# EAGLE design OSO-BOOK-C1-01 (EAGLE 9.6.2)

## Sheet 1 of 2
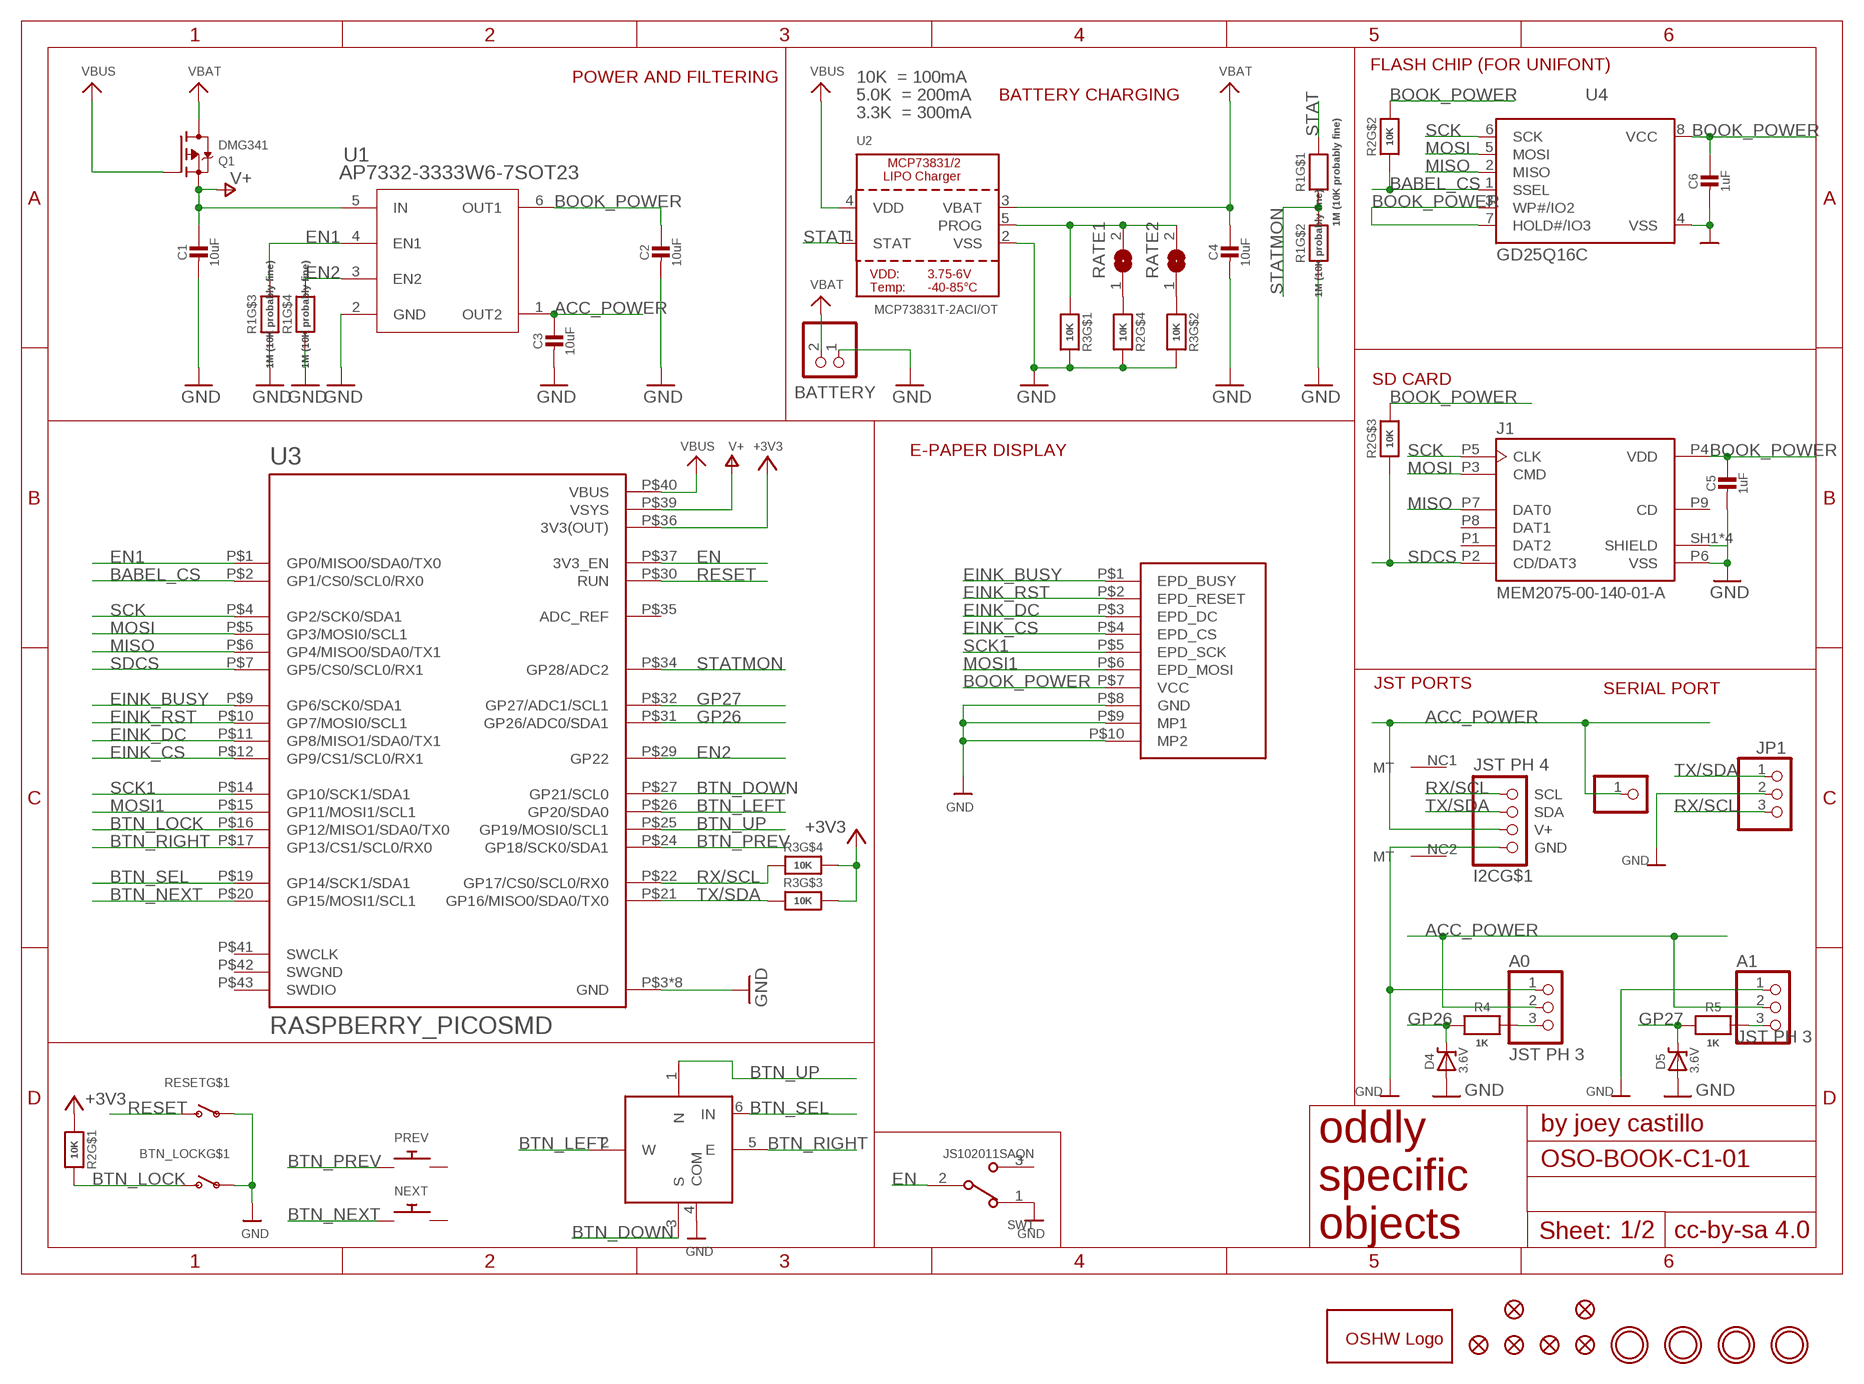
[diagram p0: schematic, sheet 1]

### Parts
A0  JST PH 3  CON_JST_PH_3PIN  [JSTPH3]
A1  JST PH 3  CON_JST_PH_3PIN  [JSTPH3]
BATTERY  JSTPH  CON_JST_PH_2PIN  [JSTPH2]
BTN_LOCK  SWITCH_SPSTTL3330A  [TL3330A]
C1  10uF  CAP_CERAMIC0805-NOOUTLINE  [0805-NO]
C2  10uF  CAP_CERAMIC0805-NOOUTLINE  [0805-NO]
C3  10uF  CAP_CERAMIC0805-NOOUTLINE  [0805-NO]
C4  10uF  CAP_CERAMIC0805-NOOUTLINE  [0805-NO]
C5  1uF  CAP_CERAMIC0805-NOOUTLINE  [0805-NO]
C6  1uF  CAP_CERAMIC0805-NOOUTLINE  [0805-NO]
D4  3.6V  DIODE-ZENERSOD123  [SOD-123]
D5  3.6V  DIODE-ZENERSOD123  [SOD-123]
FID1  FIDUCIAL_1MM  [FIDUCIAL_1MM]
FID2  FIDUCIAL_1MM  [FIDUCIAL_1MM]
FID3  FIDUCIAL_1MM  [FIDUCIAL_1MM]
FID4  FIDUCIAL_1MM  [FIDUCIAL_1MM]
FID5  FIDUCIAL_1MM  [FIDUCIAL_1MM]
FID6  FIDUCIAL_1MM  [FIDUCIAL_1MM]
GOLD_ORB_SM1  OSHWLOGOLOGO5MM  [OSHW_5MM]
I2C  JST PH 4  STEMMA_I2C_RASMT  [JSTPH4]
J1  MEM2075-00-140-01-A  [GCT_MEM2075-00-140-01-A]
JP1  PINHD-1X3  [1X03]
JP2  PINHD-1X1  [1X01]
NEXT  SWITCH_PUSHBUTTON_3.5X6MM  [TACTILE_3X6MM]
PREV  SWITCH_PUSHBUTTON_3.5X6MM  [TACTILE_3X6MM]
Q1  DMG341  MOSFET-P  [SOT23-R]
R1  1M (10K probably fine)  EXB-V8V103JV-GOOD  [EXBV8V]
R2  10K  EXB-V8V103JV-GOOD  [EXBV8V]
R3  10K  EXB-V8V103JV-GOOD  [EXBV8V]
R4  1K  RESISTOR0805_NOOUTLINE  [0805-NO]
R5  1K  RESISTOR0805_NOOUTLINE  [0805-NO]
RATE1  SOLDERJUMPER  [SOLDERJUMPER_ARROW_NOPASTE]
RATE2  SOLDERJUMPER  [SOLDERJUMPER_ARROW_NOPASTE]
RESET  SWITCH_SPSTTL3330A  [TL3330A]
SW1  JS102011SAQN  [SW_JS102011SAQN]
SW2  NAVSWITCHSKQUABAUE010  [SKQUBAE010]
U1  AP7332-3333W6-7SOT23  [SOT23-6]
U2  MCP73831T-2ACI/OT  MCP73831/2  [SOT23-5]
U3  RASPBERRY_PICOSMD  [PICO-PKG-SMD]
U4  GD25Q16C  MICROBUILDER_SPIFLASH_SOIC8  [MICROBUILDER_SOIC8_150MIL]
U$1  MOUNTINGHOLE2.5  [MOUNTINGHOLE_2.5_PLATED]
U$4  MOUNTINGHOLE2.5  [MOUNTINGHOLE_2.5_PLATED]
U$5  MOUNTINGHOLE2.5  [MOUNTINGHOLE_2.5_PLATED]
U$7  MOUNTINGHOLE2.5  [MOUNTINGHOLE_2.5_PLATED]
U$11  OSO-BOOK-C2-01  [OSO-BOOK-C2-01]

### Nets
+3V3: R2.1 R3.5 R3.6 U3.P$36(3V3(OUT))
_GP26: A0.3 R4.1
_GP27: A1.3 R5.1
ACC_POWER [power]: A0.2 A1.2 C3.1 I2C.2(V+) JP2.1 U1.1(OUT2)
BABEL_CS: R2.2 U3.P$2(GP1/CS0/SCL0/RX0) U4.1(SSEL)
BOOK_POWER [power]: C2.1 C5.1 C6.1 J1.P4(VDD) R2.6 R2.7 U1.6(OUT1) U4.3(WP#/IO2) U4.7(HOLD#/IO3) U4.8(VCC) U$11.P$7(VCC)
BTN_DOWN: SW2.3(S) U3.P$27(GP21/SCL0)
BTN_LEFT: SW2.2(W) U3.P$26(GP20/SDA0)
BTN_LOCK: BTN_LOCK.P$2(S) R2.8 U3.P$16(GP12/MISO1/SDA0/TX0)
BTN_NEXT: NEXT.P$1 U3.P$20(GP15/MOSI1/SCL1)
BTN_PREV: PREV.P$1 U3.P$24(GP18/SCK0/SDA1)
BTN_RIGHT: SW2.5(E) U3.P$17(GP13/CS1/SCL0/RX0)
BTN_SEL: SW2.6(IN) U3.P$19(GP14/SCK1/SDA1)
BTN_UP: SW2.1(N) U3.P$25(GP19/MOSI0/SCL1)
EINK_BUSY: U3.P$9(GP6/SCK0/SDA1) U$11.P$1(EPD_BUSY)
EINK_CS: U3.P$12(GP9/CS1/SCL0/RX1) U$11.P$4(EPD_CS)
EINK_DC: U3.P$11(GP8/MISO1/SDA0/TX1) U$11.P$3(EPD_DC)
EINK_RST: U3.P$10(GP7/MOSI0/SCL1) U$11.P$2(EPD_RESET)
EN: SW1.2 U3.P$37(3V3_EN)
EN1: R1.3 U1.4(EN1) U3.P$1(GP0/MISO0/SDA0/TX0)
EN2: R1.4 U1.3(EN2) U3.P$29(GP22)
GND [gnd]: A0.1 A1.1 BATTERY.1 BTN_LOCK.P$1(P) C1.2 C2.2 C3.2 C4.2 C5.2 C6.2 D4.A D5.A I2C.1(GND) J1.P6(VSS) J1.SH1(SHIELD) J1.SH2(SHIELD) J1.SH3(SHIELD) J1.SH4(SHIELD) JP1.2 R1.2 R1.5 R1.6 R2.5 R3.7 R3.8 RESET.P$1(P) SW1.1 SW2.4(COM) U1.2(GND) U2.2(VSS) U3.P$3(GND) U3.P$8(GND) U3.P$13(GND) U3.P$18(GND) U3.P$23(GND) U3.P$28(GND) U3.P$33(GND) U3.P$38(GND) U4.4(VSS) U$11.P$8(GND) U$11.P$9(MP1) U$11.P$10(MP2)
GP26: D4.C R4.2 U3.P$31(GP26/ADC0/SDA1)
GP27: D5.C R5.2 U3.P$32(GP27/ADC1/SCL1)
MISO: J1.P7(DAT0) U3.P$6(GP4/MISO0/SDA0/TX1) U4.2(MISO)
MOSI: J1.P3(CMD) U3.P$5(GP3/MOSI0/SCL1) U4.5(MOSI)
MOSI1: U3.P$15(GP11/MOSI1/SCL1) U$11.P$6(EPD_MOSI)
N$1: R2.4 RATE1.1
N$2: R3.2 RATE2.1
PROG: R3.1 RATE1.2 RATE2.2 U2.5(PROG)
RESET: RESET.P$2(S) U3.P$30(RUN)
RX/SCL: I2C.4(SCL) JP1.3 R3.4 U3.P$22(GP17/CS0/SCL0/RX0)
SCK: J1.P5(CLK) U3.P$4(GP2/SCK0/SDA1) U4.6(SCK)
SCK1: U3.P$14(GP10/SCK1/SDA1) U$11.P$5(EPD_SCK)
SDCS: J1.P2(CD/DAT3) R2.3 U3.P$7(GP5/CS0/SCL0/RX1)
STAT [power]: R1.8 U2.1(STAT)
STATMON: R1.1 R1.7 U3.P$34(GP28/ADC2)
TX/SDA: I2C.3(SDA) JP1.1 R3.3 U3.P$21(GP16/MISO0/SDA0/TX0)
V+ [power]: C1.1 Q1.2(S) U1.5(IN) U3.P$39(VSYS)
VBAT [power]: BATTERY.2 C4.1 Q1.3(D) U2.3(VBAT)
VBUS [power]: Q1.1(G) U2.4(VDD) U3.P$40(VBUS)
Unconnected: BTN_LOCK.P$3(MT) BTN_LOCK.P$4(MT) I2C.NC1(MT) I2C.NC2(MT) J1.P1(DAT2) J1.P8(DAT1) J1.P9(CD) NEXT.P$2 PREV.P$2 RESET.P$3(MT) RESET.P$4(MT) SW1.3 U3.P$35(ADC_REF) U3.P$41(SWCLK) U3.P$43(SWDIO)

### Notes on the sheet
- FLASH CHIP (FOR UNIFONT)
- POWER AND FILTERING | 10K  = 100mA
- 5.0K  = 200mA | BATTERY CHARGING
- 3.3K  = 300mA
- SD CARD
- E-PAPER DISPLAY
- JST PORTS
- SERIAL PORT

## Sheet 2 of 2
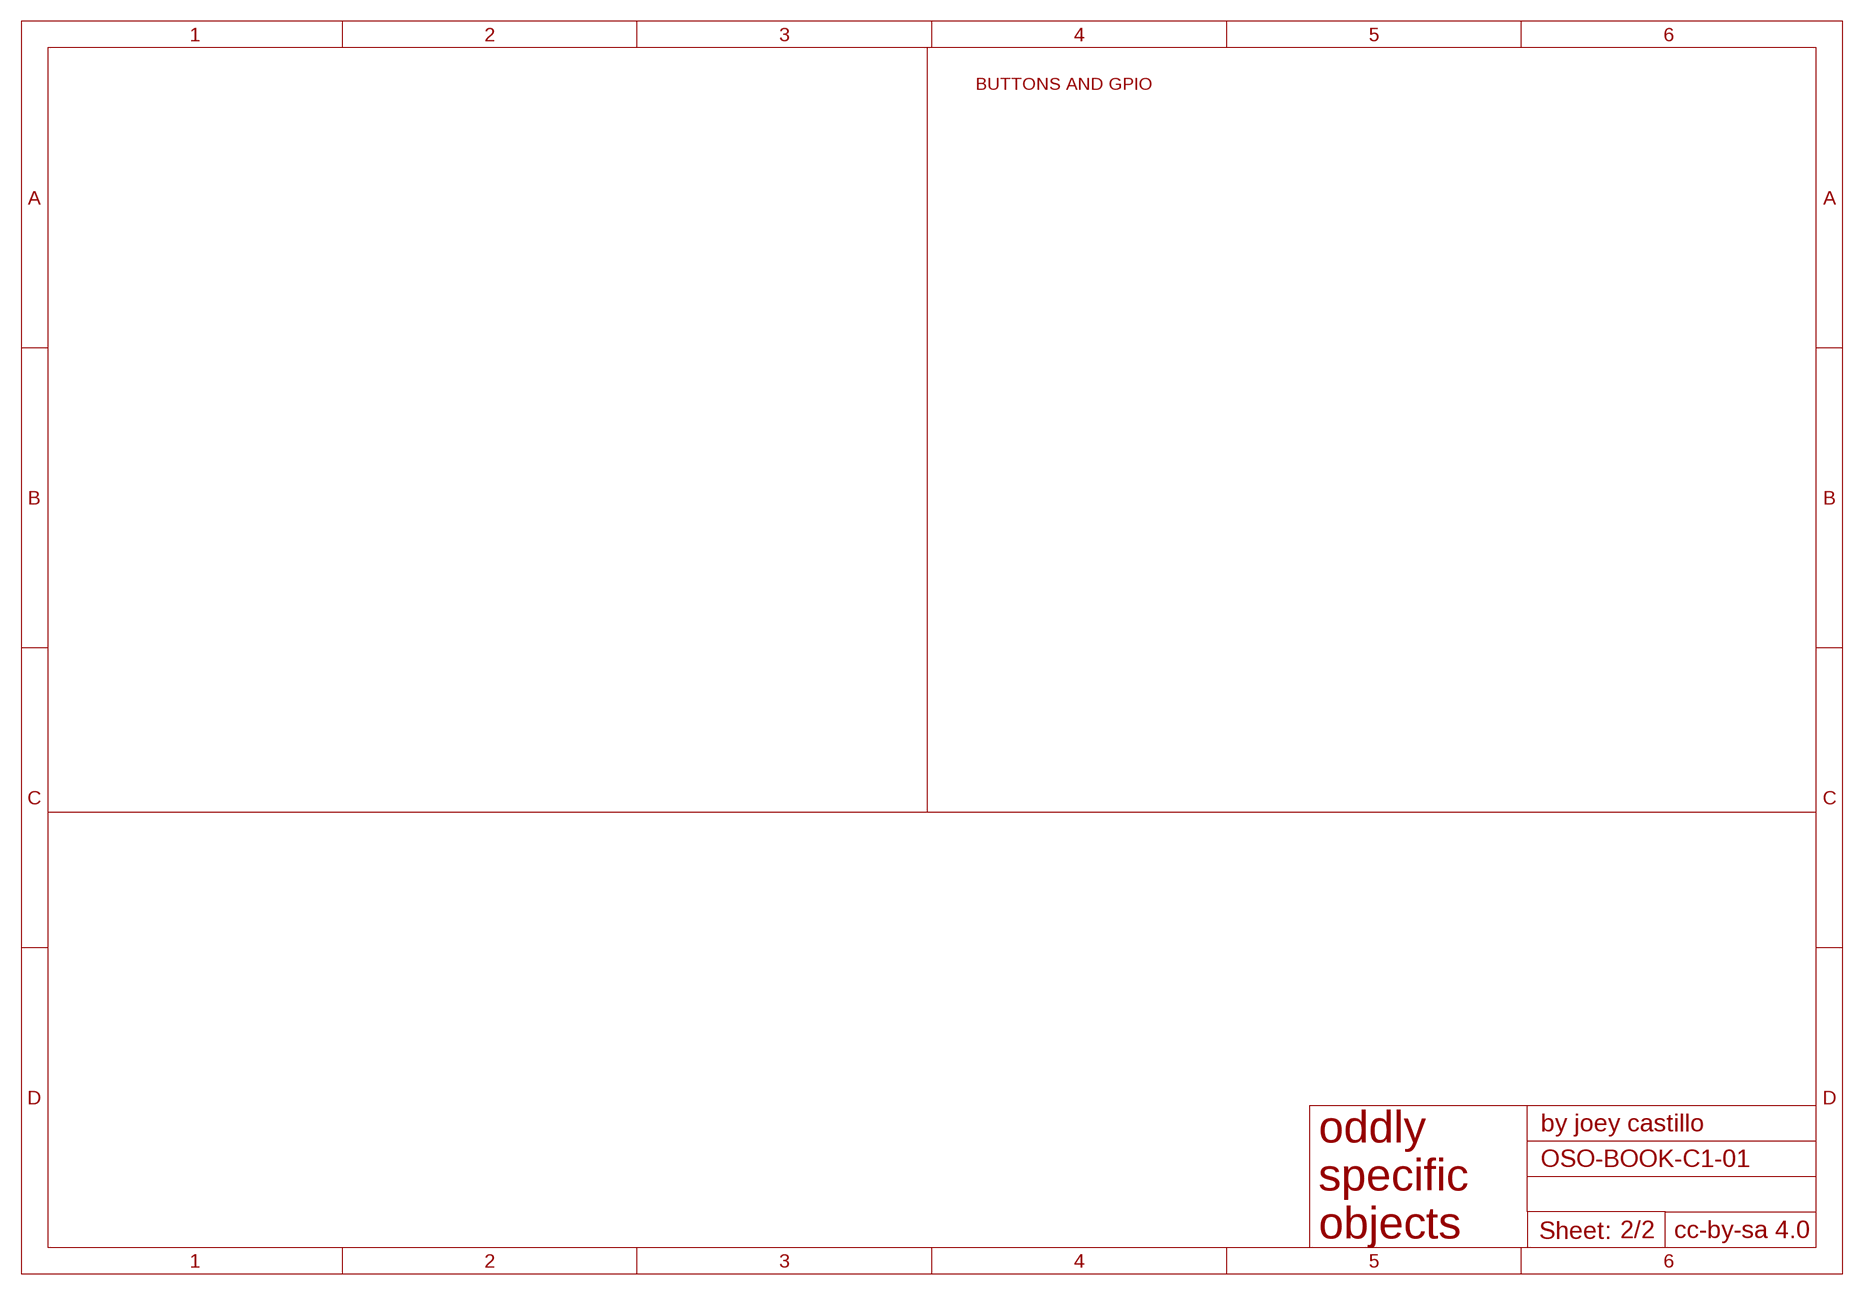
[diagram p1: schematic, sheet 2]

### Notes on the sheet
- BUTTONS AND GPIO

## Power pins joined to a net without a drawn wire
SWGND: U3.P$42(SWGND)

## Library data of the parts
A0 A1 = microbuilder:CON_JST_PH_3PIN
BATTERY = microbuilder:CON_JST_PH_2PIN: JST 2-Pin Right-Angle Connector PH-Series - 4UConnector: 17311 SH-Series - 4UConnector: 07278
BTN_LOCK RESET = oddlyspecific:SWITCH_SPST: Switch - SPST 4UCon 19192 (6.7x2.6mm SMT)
C1-C6 = microbuilder:CAP_CERAMIC: Ceramic Capacitors For new designs, use the packages preceded by an '_' character since they are more reliable: The following footprints should be used on most boards: _0402 - Standard footprint for regular board layouts _0603 - Standard footprint for regular board layouts _0805 - Standard footprint for regular board layouts _1206 - Standard footprint for regular board layouts For extremely tight-pitch boards where space is at a premium, the following 'micro-pitch' footprints can be used (smaller pads, no silkscreen outline, etc.): _0402MP - Micro-pitch footprint for very dense/compact boards _0603MP - Micro-pitch footprint for very dense/compact boards _0805MP - Micro-pitch footprint for very dense/compact boards _1206MP - Micro-pitch footprint for very dense/compact boards
D4 D5 = microbuilder:DIODE-ZENER: Zener Diode SMA: 30V 1W Zener Diode, 1.2Vf - Digikey: SMAZ30-FDICT-ND
FID1-FID6 = microbuilder:FIDUCIAL: Fiducial Alignment Points Various fiducial points for machine vision alignment.; BOM: EXCLUDE
GOLD_ORB_SM1 = oshw:OSHWLOGO: The OSHW logo for PCB layout
I2C = microbuilder:STEMMA_I2C
J1 = MEM2075-00-140-01-A:MEM2075-00-140-01-A: Micro SD Memory Card Connector, 1.4mm Profile SMT, Push-Push, with Normally open Switch; DESCRIPTION: 9 (8 + 1) Position Card Connector microSD Surface Mount, Right Angle Gold; MF: Global Connector Technology; MP: MEM2075-00-140-01-A; PACKAGE: Package
JP1 = adafruit:PINHD-1X3: PIN HEADER
JP2 = adafruit:PINHD-1X1: Pin header 1x1 for 0.1" spacing With round pins
NEXT PREV = microbuilder:SWITCH_PUSHBUTTON: Buttons SOFTTOUCHSMD_SJ - Soft touch temporary push button (Super Junk Akihabara) Compatible with SKPMANE010 [Mouser: 688-SKPMAN] C&K_KSS = Digikey: KSS221GLFS
Q1 = microbuilder:MOSFET-P: P-Channel Mosfet LEGEND VDS: Voltage Drain-Source ID: Drain Current RDS(ON): Drain-Source On-State Resistance VGS(TH): Gate-Source Threshold Voltage CISS: Drain-Source Input Capacitance SOT-23 Name VDS ID RDS(ON) VGS(TH) CISS Order Number IRLML5103 30V 760mA 600 mOhm -- 75pF @ 25V Digikey: IRLML5103PBFCT-ND IRLML6401 12V 4.3A 50 mOhm 950mV @ 250µA 830pF @ 10V Digikey: IRLML6401PBFTR-ND NTR0202PL 20V 400mA 800 mOhm 2.3V @ 250uA 70pF @ 5V Digikey: NTR0202PLT1GOSTR-ND NTR4101PT1G 20V 1.8A 85 mOhm 1.2V @ 250uA 675pF @ 10V Digikey: NTR4101PT1GOSCT-ND DMP2004K 20V 600mA 900 mOhm 1V @ 250uA 175pF @ 16V Digikey: DMP2004KDICT-ND PMV65XP 20V 3.9A 76 mOhm 950mV @ 1mA 725pF @ 20V Digikey: 568-2358-2-ND TO-252 Name VDS ID RDS(ON) VGS(TH) CISS Order Number AOD417 30V 25A 34 mOhm 3V @ 250µA 920pF @ 15V Digikey: 785-1106-2-ND PowerPak Name VDS ID RDS(ON) VGS(TH) CISS Order Number AON7401 30V 12A 14 mOhm 3V @ 250µA 2600pF @ 15V Digikey: 785-1302-1-ND
R1-R3 = resistor array:EXB-V8V103JV-GOOD; MANUFACTURER_PART_NUMBER: EXBV8V103JV; VENDOR: Panasonic
R4 R5 = microbuilder:RESISTOR: Resistors For new designs, use the packages preceded by an '_' character since they are more reliable: The following footprints should be used on most boards: _0402 - Standard footprint for regular board layouts _0603 - Standard footprint for regular board layouts _0805 - Standard footprint for regular board layouts _1206 - Standard footprint for regular board layouts For extremely tight-pitch boards where space is at a premium, the following 'micro-pitch' footprints can be used (smaller pads, no silkscreen outline, etc.): _0402MP - Micro-pitch footprint for very dense/compact boards _0603MP - Micro-pitch footprint for very dense/compact boards _0805MP - Micro-pitch footprint for very dense/compact boards _1206MP - Micro-pitch footprint for very dense/compact boards
RATE1 RATE2 = microbuilder:SOLDERJUMPER: SMD Solder JUMPER Solder the two pads together to create a connection, or remove the solder to break it. REFLOW - Use this footprint for solder paste and reflow ovens. WAVE - Use this footprint for hand-soldering (larger pads). CLOSED - Has a trace between the two pads to ensure it is closed by default. The trace needs to be cut to disable the jumper, and can be closed again by creating a solder bridge between the two pads.; BOM: EXCLUDE
SW1 = JS102011SAQN:JS102011SAQN: JS10 Series SPDT On-On 6 V 0.3 A Gull Wing SMT Slide Switch http://www.snapeda.com/parts/JS102011SAQN/C%26K%20Components/view-part/; DESCRIPTION: Slide Switch SPDT Surface Mount, Right Angle; DIGI-KEY_PART_NUMBER: 401-1999-1-ND; DIGI-KEY_PURCHASE_URL: https://www.digikey.com/product-detail/en/c-k/JS102011SAQN/401-1999-1-ND/1640114?utm_source=snapeda&utm_medium=aggregator&utm_campaign=symbol; MF: C&K; MP: JS102011SAQN; PACKAGE: None
SW2 = My Stuff:NAVSWITCH
U1 = My Stuff:AP7332-3333W6-7
U2 = microbuilder:MCP73831/2: MCP73831/2 LIPO Charger VDD: 3.75 - 6V Temp -40 - 85°C Programmable Charge Rate: 15-500mA NOTE: STAT is a tri-state logic output on the MCP73831 and an open-drain output on the MCP73832. SOT23-5 with 4.2V output and tri-state logic on STAT = MCP73831T-2ACI/OT
U3 = RpiPico:RASPBERRY_PICO: Raspberry Pi Pico
U4 = Adafruit Feather M0 Express:MICROBUILDER_SPIFLASH_SOIC8: SOIC8 SPI Flash Be careful with the size since SOIC8 flash comes in several 'widths' SOIC8 150 mil M25P16 - 16Mbit (2Mbit x 8) Serial Flash (75MHz SPI Bus), Supply: 2.7-3.6V Digikey: SOIC8 - M25P16-VMN6P-ND SOIC8 208 mil W25Q16BVSSIG - 16Mbit (2Mbit x 8) Serial Flash (104MHz SPI Bus), Supply: 2.7-3.6V Digikey: SOIC8 - W25Q16BVSSIG-ND
U$1 U$4 U$5 U$7 = microbuilder:MOUNTINGHOLE: Mounting Hole For #2 screws (0.086"/2.18mm width, 0.094"/2.4mm hole) use 2.5mm; BOM: EXCLUDE
U$11 = My Stuff:OSO-BOOK-C2-01

## Net classes
0 default: width 0.152 mm, drill 0.254 mm
1 power: width 0.254 mm, drill 0.254 mm
2 gnd: width 0.305 mm, drill 0.305 mm

## Board
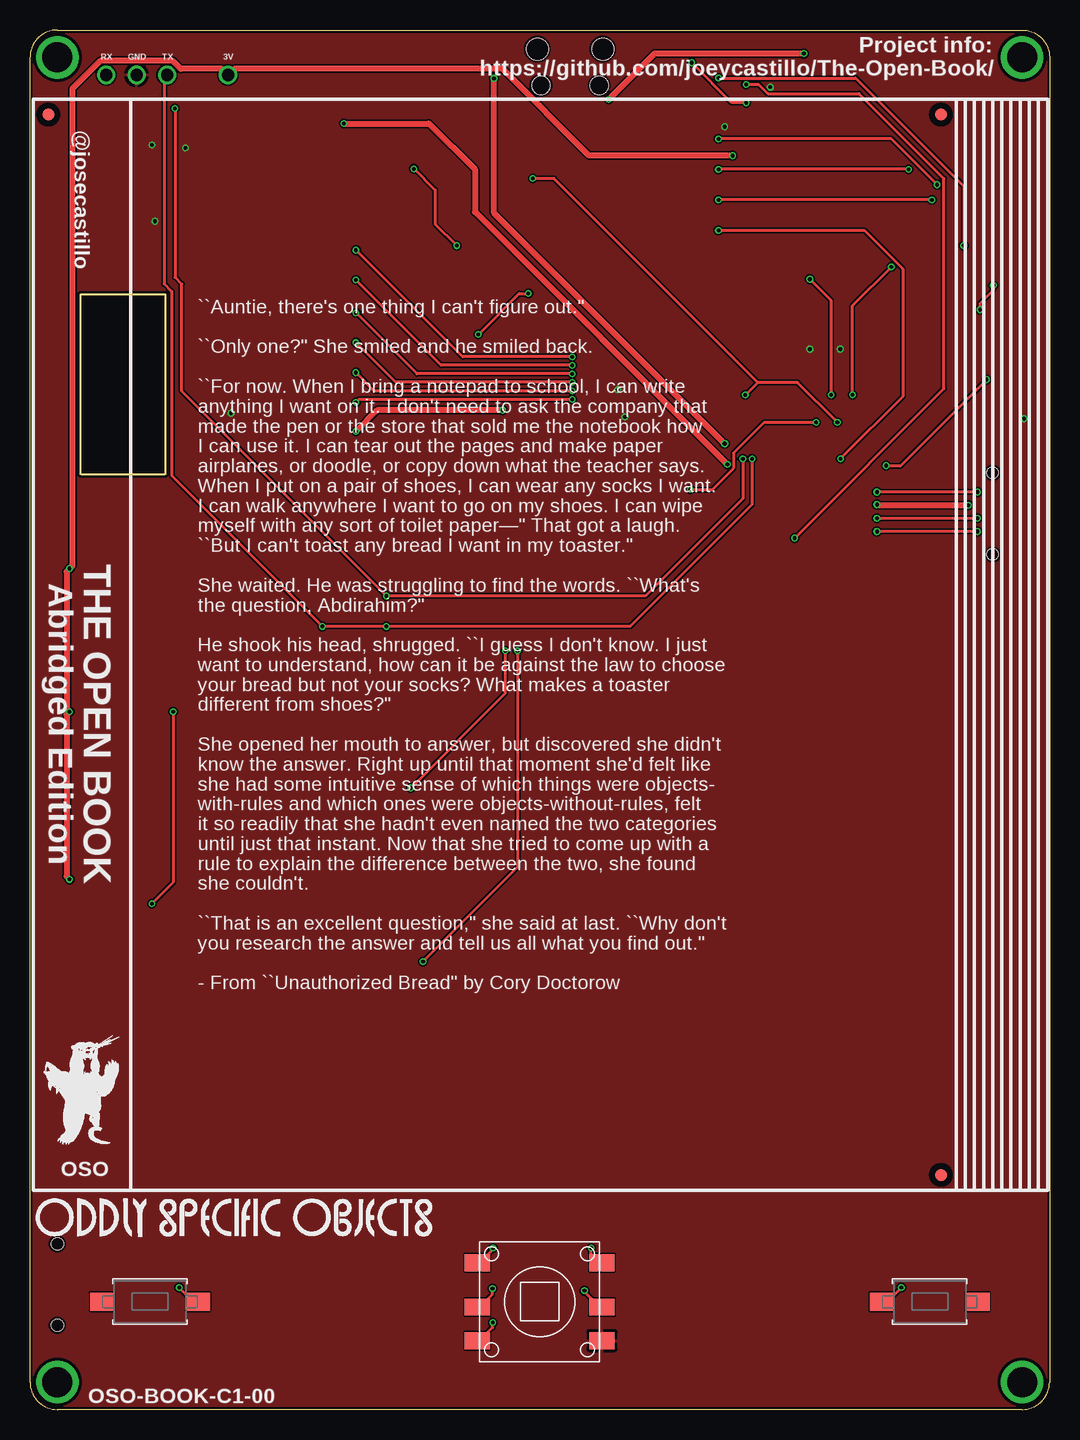
[diagram p2: board, top side]
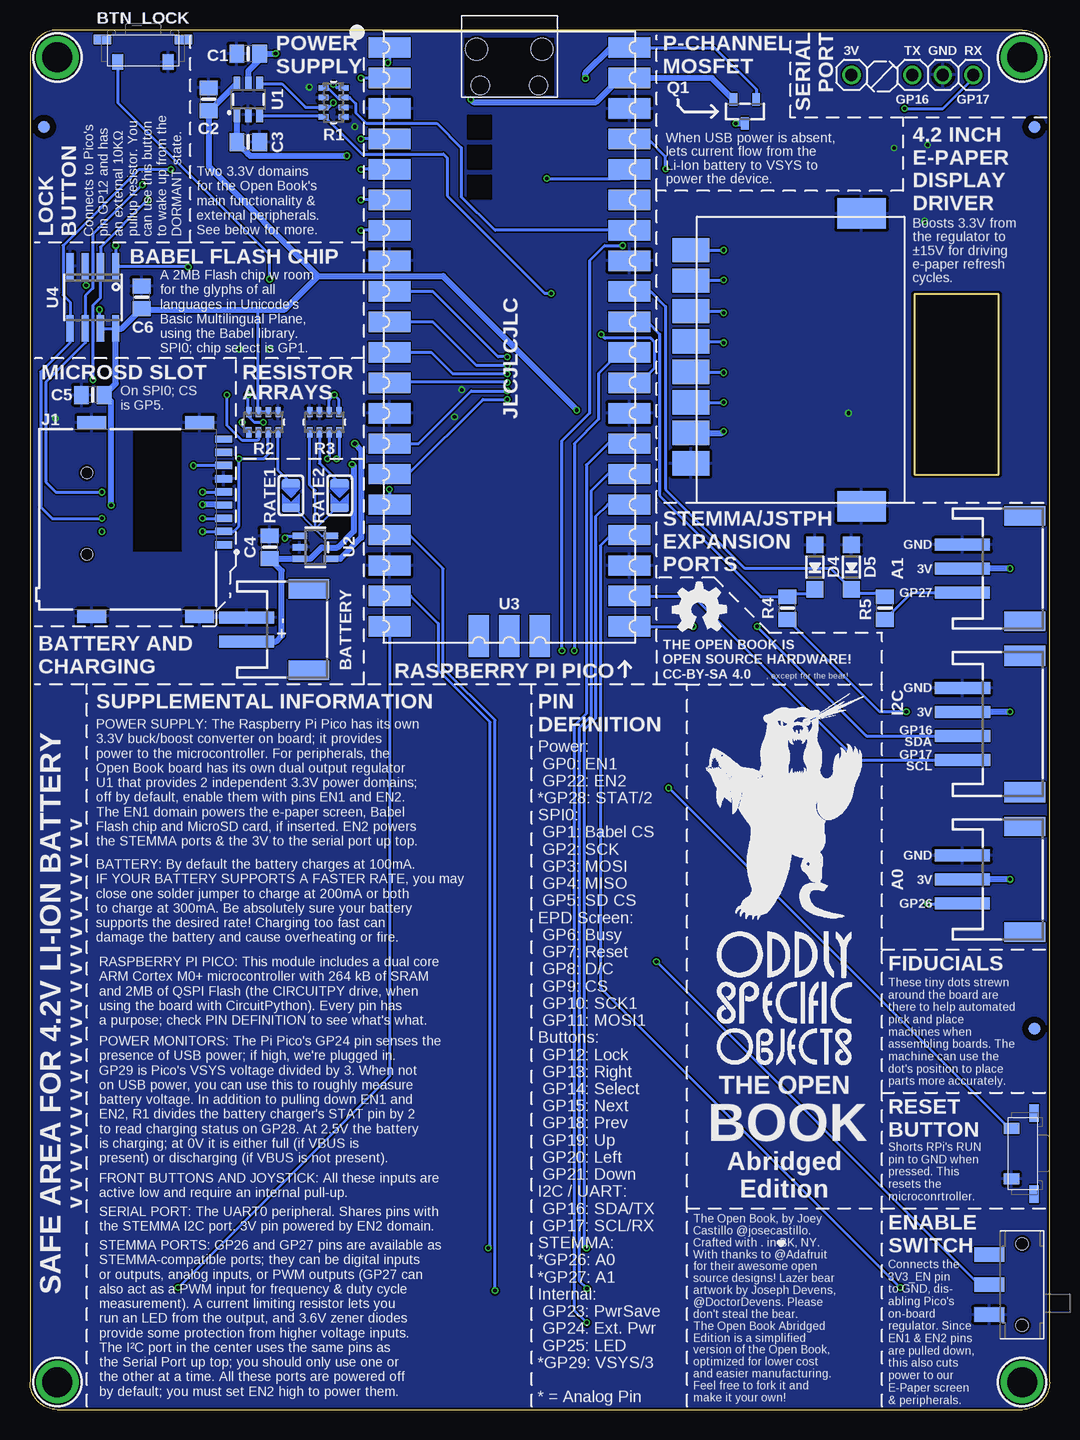
[diagram p3: board, bottom side, seen from below]

Size 85 x 115 mm. Coordinates in mm from the lower left corner, seen from the top.
Outline: 2.29,115 82.71,115 arc-90 85,112.71 85,2.29 arc-90 82.71,0 2.29,0 arc-90 0,2.29 0,112.71 arc-90 2.29,115
Outline: 4.24,92.96 11.25,92.96 11.25,77.95 4.24,77.95 4.24,92.96
Copper layers (1*16): Top 0.035559375mm / dielectric 1.6mm / Bottom 0.035559375mm
Design rules "jlcpcb2layer *": minimum track width 5mil, minimum drill 12mil, track to track 5mil, track to pad 5mil, pad to pad 5mil, via to via 5mil, smd to smd 5mil, copper to edge 8mil, drill to drill 6mil, minimum pad ring 5mil, minimum via ring 5mil, stop-mask expansion 2.5mil, vias tented up to drill 20mil, thermal gap 10mil
bKeepout: area -56,-78 to -6,-18; area 89,-143.7 to 125,-83.7; area -1,-78 to 69,-18; area 75,-78 to 125,-18; area 42,-135 to 84,-84
bRestrict: area 58.4,76.5 to 58.4,76.6; area 64,76.5 to 64.1,76.6

### Footprints (pad centres in the part's own frame; a part is rotated, then mirrored left to right if it is on the bottom)
JSTPH3 = smd 1 x 4.6: 1 -2,-2.7; 2 0,-2.7; 3 2,-2.7 | smd 1.6 x 3.4: NC1 -4.4,2.5; NC2 4.4,2.5
JSTPH2 = smd 1 x 4.6: 1 -1,-3.7; 2 1,-3.7 | smd 1.6 x 3.4: NC1 -3.4,1.5; NC2 3.4,1.5
TL3330A = smd 0.9 x 1.27: P$1 -2.1,0.89; P$2 2.1,0.89 | smd 1.45 x 0.8: P$3 -3.375,-1; P$4 3.375,-1
0805-NO = smd 1.24 x 1.5: 1 -0.95,0; 2 0.95,0
SOD-123 = smd 1.4 x 1.4: A 1.85,0; C -1.85,0
FIDUCIAL_1MM = smd 1 x 1: 1 0,0
JSTPH4 = smd 1 x 4.6: 1 -3,-3.7; 2 -1,-3.7; 3 1,-3.7; 4 3,-3.7 | smd 1.7 x 3.4: NC1 -5.7,1.5; NC2 5.7,1.5
GCT_MEM2075-00-140-01-A = smd 0.62 x 1.4: P1 2.58,11.42; P2 1.48,11.42; P3 0.38,11.42; P4 -0.72,11.42; P5 -1.82,11.42; P6 -2.92,11.42; P7 -4.02,11.42; P8 -5.12,11.42; P9 -6.22,11.42 | smd 1.1 x 2.4: SH1 -7.6,0.42; SH2 -7.6,9.42; SH3 8.55,9.42; SH4 8.55,0.42 | hole 0.95: -3.4,0; 3.4,0
1X03 = drill 1.016: 1 -2.54,0; 2 0,0; 3 2.54,0
1X01 = drill 1.016: 1 0,0
TACTILE_3X6MM = smd 2 x 1.5: P$1 -4,0; P$2 4,0
SOT23-R = smd 0.635 x 1.016: 1 -0.95,-1; 2 0.95,-1; 3 0,1
EXBV8V = smd 0.838 x 0.457: 1 -0.838,1.219; 2 -0.838,0.406; 3 -0.838,-0.406; 4 -0.838,-1.219; 5 0.838,-1.219; 6 0.838,-0.406; 7 0.838,0.406; 8 0.838,1.219
SOLDERJUMPER_ARROW_NOPASTE = smd 0.762 x 1.524: 1 -1.016,0; 2 1.016,0
SW_JS102011SAQN = smd 1.2 x 2.5: 1 -2.5,2.75; 2 0,2.75; 3 2.5,2.75 | hole 1: -3.4,0; 3.4,0
SKQUBAE010 = smd 2.1 x 1.4: 1 -5.2,3.25; 2 -5.2,-0.45; 3 -5.2,-3.25; 4 5.2,-3.25; 5 5.2,-0.45; 6 5.2,3.25
SOT23-6 = smd 0.55 x 1.2: 1 0.95,1.3; 2 0,1.3; 3 -0.95,1.3; 4 -0.95,-1.3; 5 0,-1.3; 6 0.95,-1.3
SOT23-5 = smd 0.55 x 1.2: 1 -0.95,-1.3; 2 0,-1.3; 3 0.95,-1.3; 4 0.95,1.3; 5 -0.95,1.3
PICO-PKG-SMD = smd 3.5 x 1.7: P$1 -10,24.13; P$2 -10,21.59; P$3 -10,19.05; P$4 -10,16.51; P$5 -10,13.97; P$6 -10,11.43; P$7 -10,8.89; P$8 -10,6.35; P$9 -10,3.81; P$10 -10,1.27; P$11 -10,-1.27; P$12 -10,-3.81; P$13 -10,-6.35; P$14 -10,-8.89; P$15 -10,-11.43; P$16 -10,-13.97; P$17 -10,-16.51; P$18 -10,-19.05; P$19 -10,-21.59; P$20 -10,-24.13; P$21 10,-24.13; P$22 10,-21.59; P$23 10,-19.05; P$24 10,-16.51; P$25 10,-13.97; P$26 10,-11.43; P$27 10,-8.89; P$28 10,-6.35; P$29 10,-3.81; P$30 10,-1.27; P$31 10,1.27; P$32 10,3.81; P$33 10,6.35; P$34 10,8.89; P$35 10,11.43; P$36 10,13.97; P$37 10,16.51; P$38 10,19.05; P$39 10,21.59; P$40 10,24.13 | smd 1.7 x 3.5: P$41 -2.54,-24.925; P$42 0,-24.925; P$43 2.54,-24.925 | hole 1.8: -2.725,24; 2.725,24 | hole 1.5: -2.425,20.97; 2.425,20.97
MICROBUILDER_SOIC8_150MIL = smd 0.6 x 2.2: 1 -1.905,-2.6; 2 -0.635,-2.6; 3 0.635,-2.6; 4 1.905,-2.6; 5 1.905,2.6; 6 0.635,2.6; 7 -0.635,2.6; 8 -1.905,2.6
MOUNTINGHOLE_2.5_PLATED = drill 2.5 pad 3.2: P$1 0,0
OSO-BOOK-C2-01 = smd 3.048 x 2.032: P$1 -9.144,9.144; P$2 -9.144,6.604; P$3 -9.144,4.064; P$4 -9.144,1.524; P$5 -9.144,-1.016; P$6 -9.144,-3.556; P$7 -9.144,-6.096; P$8 -9.144,-8.636 | smd 4.064 x 2.54: P$9 5.08,-12.192; P$10 5.08,12.192

### Placement (x,y rotation side)
A0  4.57,44.2 270 bottom
A1  4.57,70.1 270 bottom
BATTERY  63.25,65.02 270 bottom
BTN_LOCK  75.58,113.22 180 bottom
C1  66.8,113.03 180 bottom
C2  70.1,109.22 90 bottom
C3  66.8,105.66 0 bottom
C4  65.02,71.88 90 bottom
C5  79.76,84.58 180 bottom
C6  75.69,92.71 90 bottom
D4  19.56,70.23 90 bottom
D5  16.51,70.23 90 bottom
FID1  83.82,106.93 0 bottom
FID2  75.95,19.56 0 top
FID3  1.27,106.93 0 bottom
FID4  75.95,107.95 0 top
FID5  1.27,31.75 0 bottom
FID6  1.52,107.95 0 top
GOLD_ORB_SM1  29.21,66.67 0 bottom
I2C  3.56,57.15 270 bottom
J1  80.26,74.68 270 bottom
JP1  8.89,111.25 0 bottom
JP2  16.51,111.25 0 bottom
NEXT  75,9 0 top
PREV  10,9 180 top
Q1  25.4,108.2 180 bottom
R1  59.69,108.97 0 bottom
R2  65.53,82.3 90 bottom
R3  60.45,82.3 90 bottom
R4  21.84,66.8 90 bottom
R5  13.72,66.8 90 bottom
RATE1  63.25,76.2 270 bottom
RATE2  59.18,76.2 270 bottom
RESET  2.29,21.34 90 bottom
SW1  2.29,10.41 90 bottom
SW2  42.49,8.99 0 top
U1  66.8,109.22 180 bottom
U2  61.21,71.88 270 bottom
U3  45.03,89.41 0 bottom
U4  79.76,92.71 180 bottom
U$1  2.29,2.29 0 bottom
U$4  82.71,2.29 0 bottom
U$5  2.29,112.71 0 bottom
U$7  82.71,112.71 0 bottom
U$11  20.75,87.5 0 bottom
U$45  [OSO_WORDMARK_125X1300MIL_1000DPI]  0.51,16 0 top
U$47  [OSO_BEAR_525X750MIL_1000DPI]  22.1,50.29 0 bottom
U$49  [OSO_WORDMARK_THREELINE_450MIL_1000DPI]  22.1,34.29 0 bottom
U$65  [OSO_BEAR_250X360MIL_1000DPI]  4.32,26.67 0 top

### Tracks (layer width: path | path; a pad name or v marks a point on that pad's centre or on a via)
+3V3  (via drill 0.3)
  Top 0.254: v41.91,102.62 43.69,102.62 60.68,85.62 | 60.68,85.62 63.98,85.62 v67.31,82.3 | v59.64,84.58 60.68,85.62
  Bottom 0.254: U3.P$36 35.8,102.62 v41.91,102.62 | R2.1 67.31,82.02 v67.31,82.3 | R3.6 60.05,84.18 v59.64,84.58 59.23,84.18 R3.5
_GP26  (via drill 0.3)
  Top 0.254: v11.94,58.17 11.94,43.94 v10.16,42.16
  Bottom 0.254: v11.94,58.17 14.16,58.17 R4.1 | v10.16,42.16 7.3,42.16 A0.3
_GP27
  Bottom 0.254: R5.1 11.46,68.1 A1.3
ACC_POWER  (via drill 0.3)
  Top 0.508: v58.57,104.52 46.62,104.52 39.38,111.76 17.02,111.76 JP2.1 16,111.76 12.57,111.76 11.91,112.42 5.87,112.42 3.53,110.08 3.53,70.33 v3.3,70.1 3.05,69.85 3.05,58.42 v3.3,58.17 3.05,57.91 3.05,44.45 v3.3,44.2
  Bottom 0.508: U1.1 C3.1 66.88,104.79 66.88,104.75 66.64,104.51 58.59,104.51 v58.57,104.52 | v3.3,70.1 A1.2 | v3.3,58.17 7.24,58.17 I2C.2 | v3.3,44.2 A0.2
BABEL_CS  (via drill 0.3)
  Top 0.254: v68.58,84.58 68.58,92.01 v71.81,95.25 | v57.4,111 68.83,111 77.85,101.98 v77.85,97.03
  Bottom 0.254: v71.81,95.25 71.88,95.31 U4.1 v77.85,97.03 | U3.P$2 v57.4,111 | R2.2 65.94,80.87 66.04,80.77 67.31,80.77 68.58,82.04 v68.58,84.58
BOOK_POWER  (via drill 0.3)
  Top 0.254: v80.31,93.71 80.31,93.31 79.2,92.2 v79.2,91.69
  Top 0.508: v39.42,83.31 28.96,83.31 v27.18,81.53 | v70.61,75.44 70.66,75.39 v78.23,75.39
  Bottom 0.254: v79.2,91.69 79.2,90.19 U4.7 U4.8 | U4.3 80.39,93.79 v80.31,93.71 | 66.04,91.69 66.04,83.24 R2.7 R2.6
  Bottom 0.508: U1.6 70,108.27 C2.1 70.1,103.63 60.96,94.49 | v39.42,83.31 39.42,83.36 50.55,94.49 60.96,94.49 | 60.96,94.49 63.75,91.69 66.04,91.69 75.63,91.69 C6.1 77.34,90.11 U4.8 77.85,85.54 C5.1 78.79,84.58 78.23,84.02 v78.23,75.39 | U$11.P$7 27.3,81.41 v27.18,81.53 | J1.P4 68.89,75.44 v70.61,75.44
BTN_DOWN  (via drill 0.3)
  Top 0.254: SW2.3 37.47,5.74 38.58,6.85 v38.58,7.24
  Bottom 0.254: v38.58,7.24 39.63,8.29 39.63,56.99 38.61,58.01 38.61,78.74 36.83,80.52 U3.P$27
BTN_LEFT  (via drill 0.3)
  Top 0.254: SW2.2 37.47,8.54 38.56,9.62 v38.56,10.08
  Bottom 0.254: v38.56,10.08 39.22,10.74 39.22,56.81 38.23,57.8 38.23,76.58 36.83,77.98 U3.P$26
BTN_LOCK  (via drill 0.3)
  Top 0.254: v65.02,94.23 66.8,92.46 v66.8,84.58 | v65.53,82.3 61.21,82.3 58.67,79.76 58.67,78.49 56.9,76.71 v55.04,76.71
  Bottom 0.254: BTN_LOCK.P$2 77.68,108.93 65.02,96.27 v65.02,94.23 | v55.04,76.71 v55.03,76.7 U3.P$16 | v66.8,84.58 66.8,83.19 R2.8 66.75,82.75 66.29,82.3 v65.53,82.3
BTN_NEXT  (via drill 0.3)
  Top 0.254: v72.64,10.16 71.48,9 NEXT.P$1
  Bottom 0.254: U3.P$20 55.03,27.77 v72.64,10.16
BTN_PREV  (via drill 0.3)
  Top 0.254: PREV.P$1 13.61,9 v12.45,10.16
  Bottom 0.254: U3.P$24 36.56,72.9 37.45,72.01 37.45,35.16 v12.45,10.16
BTN_RIGHT  (via drill 0.3)
  Top 0.254: SW2.5 47.52,8.54 46.23,9.83 v46.23,9.91
  Bottom 0.254: U3.P$17 53.34,72.9 50.55,70.1 50.55,61.79 46.23,57.47 v46.23,9.91
BTN_SEL  (via drill 0.3)
  Top 0.254: SW2.6 47.49,12.24 46.79,12.94 v46.79,13.46
  Bottom 0.254: v46.79,13.46 46.63,13.61 46.63,57.3 50.97,61.64 50.97,65.53 53.26,67.82 U3.P$19
BTN_UP  (via drill 0.3)
  Top 0.254: SW2.1 37.49,12.24 38.61,13.36 v38.61,13.46
  Bottom 0.254: v38.61,13.46 38.81,13.66 38.81,56.64 37.85,57.61 37.85,74.42 36.83,75.44 U3.P$25
EINK_BUSY  (via drill 0.3)
  Top 0.254: v45.21,87.76 36.07,87.76 v27.18,96.65
  Bottom 0.254: v45.21,87.76 45.97,87.76 51.43,93.22 U3.P$9 | U$11.P$1 v27.18,96.65
EINK_CS  (via drill 0.3)
  Top 0.254: v45.21,85.63 30.48,85.63 v27.18,88.93
  Bottom 0.254: v45.21,85.63 55.01,85.63 U3.P$12 | U$11.P$4 27.27,89.03 v27.18,88.93
EINK_DC  (via drill 0.3)
  Top 0.254: v45.21,86.34 32.26,86.34 v27.18,91.42
  Bottom 0.254: v45.21,86.34 49.75,86.34 51.55,88.14 U3.P$11 | U$11.P$3 27.33,91.57 v27.18,91.42
EINK_RST  (via drill 0.3)
  Top 0.254: v45.21,87.05 34.29,87.05 v27.18,94.16
  Bottom 0.254: v45.21,87.05 47.8,87.05 51.43,90.68 U3.P$10 | U$11.P$2 29.84,94.16 v27.18,94.16
EN  (via drill 0.3)
  Top 0.254: v32.77,37.34 40.64,45.21 v40.64,63.25 | v32,103.43 33.78,101.65 33.78,98.83 v35.59,97.03
  Bottom 0.254: SW1.2 5.84,10.41 v32.77,37.34 | v32,103.43 32,104.44 33.48,105.92 U3.P$37 | v40.64,63.25 40.64,80.77 38.35,83.06 38.35,95.76 37.08,97.03 v35.59,97.03
EN1  (via drill 0.3)
  Top 0.254: v59.7,108.94 58.5,108.94 v55.17,112.27
  Bottom 0.254: U1.4 63.99,110.52 62.03,108.56 R1.3 60.08,108.56 v59.7,108.94 | U3.P$1 55.03,112.4 v55.17,112.27
EN2  (via drill 0.3)
  Top 0.254: v41.55,93.04 40.79,93.04 v37.38,89.62
  Bottom 0.254: U1.3 65.78,107.84 60.62,107.84 R1.4 60.4,107.75 57.32,104.66 50.53,104.66 50.22,104.34 50.22,101.19 42.06,93.04 v41.55,93.04 | U3.P$29 34.16,85.6 32.89,86.87 32.89,88.95 33.23,89.29 37.05,89.29 v37.38,89.62
GND  (via drill 0.3)
  other vias: 82.88,82.6 65.02,88.39 61.72,110.24 57.91,106.93 10.41,99.06 10.16,105.41 12.95,105.16 16.76,83.06 67.56,88.39 49,85.01 49.61,82.75
  pour Bottom: 85.23,114.81 0.76,114.81 -2.29,111.76 -2.29,1.27 0.76,-1.78 85.23,-1.78
  pour Top: 85.74,114.81 -1.52,114.81 -4.06,112.27 -4.06,-3.03 85.74,-3.03
GP26
  Bottom 0.254: U3.P$31 33.53,90.68 32.51,89.66 32.51,76.2 24.06,67.75 R4.2 21.59,68.01 19.93,68.01 D4.C
GP27
  Bottom 0.254: R5.2 14.05,68.08 16.21,68.08 D5.C 18.29,70.16 25.45,70.16 32,76.71 32,91.95 33.27,93.22 U3.P$32
MISO  (via drill 0.3)
  Top 0.254: v75.18,100.84 v57.4,100.84 | v71.37,78.69 72.59,78.69 v79.76,85.85
  Bottom 0.254: v75.18,100.84 79.12,96.9 U4.2 79.12,92.67 79.76,92.03 v79.76,85.85 | U3.P$6 v57.4,100.84 | J1.P7 v71.36,78.7 v71.37,78.69
MOSI  (via drill 0.3)
  Top 0.254: v73.25,103.38 v57.4,103.38 | v78.99,74.29 v70.61,74.29
  Bottom 0.254: v73.25,103.38 75.9,103.38 82.24,97.03 82.24,92.9 81.66,92.32 U4.5 81.66,88.94 84.11,86.49 84.11,75.22 83.19,74.3 83.18,74.29 v78.99,74.29 | U3.P$5 v57.4,103.38 | v70.61,74.29 68.85,74.29 J1.P3
MOSI1  (via drill 0.3)
  Top 0.254: v27.18,83.95 27.43,84.2 v45.21,84.2
  Bottom 0.254: v45.21,84.2 47.24,84.2 53.47,77.98 U3.P$15 | U$11.P$6 v27.18,83.95
N$1
  Bottom 0.254: RATE1.1 64.31,78.28 R2.4
N$2
  Bottom 0.254: R3.2 60.86,78.89 RATE2.1
PROG
  Bottom 0.203: 61.21,73.41 61.21,76.61 | 61.21,73.41 60.64,72.83 U2.5 | RATE1.2 62.99,75.18 61.21,73.41 | RATE2.2 59.44,75.18 61.21,73.41
  Bottom 0.254: 61.21,76.61 61.67,77.06 R3.1
RESET  (via drill 0.3)
  Top 0.254: v31.75,51.82 39.62,59.69 v39.62,63.25
  Bottom 0.254: RESET.P$2 3.37,23.44 v31.75,51.82 | v39.62,63.25 39.62,80.52 37.59,82.55 37.59,86.36 35.81,88.14 U3.P$30
RX/SCL  (via drill 0.3)
  Top 0.254: v12.09,108.46 12.09,94.39 12.65,93.83 12.65,84.89 v29.72,67.82 51.31,67.82 59.44,75.95 v59.44,79.25
  Bottom 0.254: I2C.4 16.05,54.15 v29.72,67.82 U3.P$22 | v12.09,108.46 8.89,108.46 6.35,111 JP1.3 | R3.4 59.23,79.43 59.41,79.25 v59.44,79.25
SCK  (via drill 0.3)
  Top 0.254: v75.63,102.11 71.82,105.92 v57.4,105.92 | v78.99,76.49 v70.61,76.49
  Bottom 0.254: v75.63,102.11 79.75,97.99 79.75,93.48 80.39,92.84 U4.6 80.39,88.92 83.67,85.65 83.67,77.32 82.84,76.49 v78.99,76.49 | U3.P$4 v57.4,105.92 | v70.61,76.49 68.85,76.49 J1.P5
SCK1  (via drill 0.3)
  Top 0.254: v45.21,84.92 28.7,84.92 v27.18,86.44
  Bottom 0.254: v45.21,84.92 48.22,84.92 52.62,80.52 U3.P$14 | U$11.P$5 27.22,86.49 v27.18,86.44
SDCS  (via drill 0.3)
  Top 0.254: v57.4,98.3 69.56,98.3 72.75,95.1 72.75,84.44 v67.58,79.26 | v78.99,73.19 v70.61,73.19
  Bottom 0.254: U3.P$7 v57.4,98.3 | v70.61,73.19 68.85,73.19 J1.P2 68.03,73.2 67.56,73.66 67.56,79.25 v67.58,79.26 65.52,79.26 65.13,79.65 R2.3
STAT  (via drill 0.3)
  Top 0.254: v59.7,110.47 60.74,110.47 61.5,109.7 69.11,109.7 76.2,102.62 76.2,85.09 v63.75,72.64
  Bottom 0.254: R1.8 59.42,110.19 v59.7,110.47 | v63.75,72.64 63.57,72.83 U2.1
STATMON
  Bottom 0.254: U3.P$34 46.23,98.3 49.05,101.12 49.05,105.21 51.07,107.23 56.98,107.23 57.84,108.09 57.84,108.86 58.34,109.37 R1.7 59.36,109.37 60.17,110.19 R1.1
TX/SDA  (via drill 0.3)
  Top 0.254: JP1.1 11.18,111 11.18,93.85 11.82,93.2 11.82,77.84 v24.38,65.28 v29.72,65.28 50.04,65.28 60.2,75.44 v60.2,79.25
  Bottom 0.254: v24.38,65.28 15.26,56.15 I2C.3 | U3.P$21 v29.72,65.28 | R3.3 60.05,79.4 v60.2,79.25
V+  (via drill 0.3)
  Top 0.508: v64.52,113.03 52.07,113.03 v48.26,109.22
  Bottom 0.508: v64.52,113.03 C1.1 65.85,112.53 66.8,111.58 U1.5 | v48.26,109.22 48.03,108.99 37.82,108.99 35.81,111 U3.P$39 28.14,111 Q1.2
VBAT  (via drill 0.3)
  Top 0.508: v26.16,107.2 33.26,107.2 37.08,103.38 37.08,99.85 v58.14,78.79
  Bottom 0.508: BATTERY.2 64.5,64.02 64.01,64.52 64.01,69.92 C4.1 U2.3 61.62,70.93 60.68,71.87 59.37,71.87 58.01,73.22 58.01,78.66 v58.14,78.79 | Q1.3 v26.16,107.2
VBUS  (via drill 0.3, 0.35)
  Top 0.508: v38.68,110.97 v38.69,110.97 38.69,99.74 v57.91,80.52
  Bottom 0.254: U3.P$40 27.94,113.54 24.45,110.05 Q1.1
  Bottom 0.508: v38.68,110.97 38.68,111.43 36.58,113.54 U3.P$40 | v57.91,80.52 v57.91,80.51 57.38,79.98 57.38,72.67 59.12,70.93 U2.4

### Text on the board
tPlace: Project info: | RX | GND | TX | 3V | https://github.com/joeycastillo/The-Open-Book/ | @josecastillo | ``Auntie, there's one thing I can't figure out." / / ``Only one?" She smiled and he smiled back. / / ``For now. When I bring a notepad to school, I can write / anything I want on it. I don't need to ask the company that / made the pen or the store that sold me the notebook how / I can use it. I can tear out the pages and make paper / airplanes, or doodle, or copy down what the teacher says. / When I put on a pair of shoes, I can wear any socks I want. / I can walk anywhere I want to go on my shoes. I can wipe / myself with any sort of toilet paper—" That got a laugh. / ``But I can't toast any bread I want in my toaster." / / She waited. He was struggling to find the words. ``What's / the question, Abdirahim?" / / He shook his head, shrugged. ``I guess I don't know. I just / want to understand, how can it be against the law to choose / your bread but not your socks? What makes a toaster / different from shoes?" / / She opened her mouth to answer, but discovered she didn't / know the answer. Right up until that moment she'd felt like / she had some intuitive sense of which things were objects- / with-rules and which ones were objects-without-rules, felt / it so readily that she hadn't even named the two categories / until just that instant. Now that she tried to come up with a / rule to explain the difference between the two, she found / she couldn't. / / ``That is an excellent question," she said at last. ``Why don't / you research the answer and tell us all what you find out." / / - From ``Unauthorized Bread" by Cory Doctorow | Abridged Edition | THE OPEN BOOK | OSO | OSO-BOOK-C1-00
bPlace: SERIAL / PORT | P-CHANNEL / MOSFET | POWER / SUPPLY | RX | GND | TX | 3V | GP17 | GP16 | 4.2 INCH / E-PAPER / DISPLAY / DRIVER | When USB power is absent, / lets current flow from the / Li-Ion battery to VSYS to / power the device. | Two 3.3V domains / for the Open Book's / main functionality & / external peripherals. / See below for more. | Boosts 3.3V from / the regulator to / ±15V for driving / e-paper refresh / cycles. | Connects to Pico's / pin GP12 and has / an external 10KΩ / pullup resistor. You / can use this button / to wake up from the / DORMANT state. | LOCK / BUTTON | BABEL FLASH CHIP | A 2MB Flash chip w room / for the glyphs of all / languages in Unicode's / Basic Multilingual Plane, / using the Babel library. / SPI0; chip select is GP1. | JLCJLCJLC | RESISTOR / ARRAYS | MICROSD SLOT | On SPI0; CS / is GP5. | STEMMA/JSTPH / EXPANSION / PORTS | GND | 3V | GP27 | + - | BATTERY AND / CHARGING | THE OPEN BOOK IS / OPEN SOURCE HARDWARE! / CC-BY-SA 4.0 | RASPBERRY PI PICO | , except for the bear! | GND | PIN / DEFINITION | SUPPLEMENTAL INFORMATION | 3V | POWER SUPPLY: The Raspberry Pi Pico has its own / 3.3V buck/boost converter on board; it provides / power to the microcontroller. For peripherals, the / Open Book board has its own dual output regulator / U1 that provides 2 independent 3.3V power domains; / off by default, enable them with pins EN1 and EN2. / The EN1 domain powers the e-paper screen, Babel / Flash chip and MicroSD card, if inserted. EN2 powers / the STEMMA ports & the 3V to the serial port up top. | GP16 / SDA | Power: / GP0: EN1 / GP22: EN2 / *GP28: STAT/2 / SPI0: / GP1: Babel CS / GP2: SCK / GP3: MOSI / GP4: MISO / GP5: SD CS / EPD Screen: / GP6: Busy / GP7: Reset / GP8: D/C / GP9: CS / GP10: SCK1 / GP11: MOSI1 / Buttons: / GP12: Lock / GP13: Right / GP14: Select / GP15: Next / GP18: Prev / GP19: Up / GP20: Left / GP21: Down / I2C / UART: / GP16: SDA/TX / GP17: SCL/RX / STEMMA: / *GP26: A0 / *GP27: A1 / Internal: / GP23: PwrSave / GP24: Ext. Pwr / GP25: LED / *GP29: VSYS/3 / / * = Analog Pin | GP17 / SCL | GND | BATTERY: By default the battery charges at 100mA. / IF YOUR BATTERY SUPPORTS A FASTER RATE, you may / close one solder jumper to charge at 200mA or both / to charge at 300mA. Be absolutely sure your battery / supports the desired rate! Charging too fast can / damage the battery and cause overheating or fire. | 3V | GP26 | FIDUCIALS | RASPBERRY PI PICO: This module includes a dual core / ARM Cortex M0+ microcontroller with 264 kB of SRAM / and 2MB of QSPI Flash (the CIRCUITPY drive, when / using the board with CircuitPython). Every pin has / a purpose; check PIN DEFINITION to see what's what. | These tiny dots strewn / around the board are / there to help automated / pick and place / machines when / assembling boards. The / machine can use the / dot's position to place / parts more accurately. | v v v v v v v v v v v v v v v v v v v v v v | SAFE AREA FOR 4.2V LI-ION BATTERY | POWER MONITORS: The Pi Pico's GP24 pin senses the / presence of USB power; if high, we're plugged in. / GP29 is Pico's VSYS voltage divided by 3. When not / on USB power, you can use this to roughly measure / battery voltage. In addition to pulling down EN1 and / EN2, R1 divides the battery charger's STAT pin by 2 / to read charging status on GP28. At 2.5V the battery / is charging; at 0V it is either full (if VBUS is / present) or discharging (if VBUS is not present). | THE OPEN | RESET / BUTTON | BOOK | Shorts RPi's RUN / pin to GND when / pressed. This / resets the / microconrtroller. | Abridged / Edition | FRONT BUTTONS AND JOYSTICK: All these inputs are / active low and require an internal pull-up. | SERIAL PORT: The UART0 peripheral. Shares pins with / the STEMMA I2C port. 3V pin powered by EN2 domain. | ENABLE / SWITCH | The Open Book, by Joey / Castillo @josecastillo. / Crafted with . in BK, NY. / With thanks to @Adafruit / for their awesome open / source designs! Lazer bear / artwork by Joseph Devens, / @DoctorDevens. Please / don't steal the bear. / The Open Book Abridged / Edition is a simplified / version of the Open Book, / optimized for lower cost / and easier manufacturing. / Feel free to fork it and / make it your own! | STEMMA PORTS: GP26 and GP27 pins are available as / STEMMA-compatible ports; they can be digital inputs / or outputs, analog inputs, or PWM outputs (GP27 can / also act as a PWM input for frequency & duty cycle / measurement). A current limiting resistor lets you / run an LED from the output, and 3.6V zener diodes / provide some protection from higher voltage inputs. / The I²C port in the center uses the same pins as / the Serial Port up top; you should only use one or / the other at a time. All these ports are powered off / by default; you must set EN2 high to power them. | Connects the / 3V3_EN pin / to GND, dis- / abling Pico's / on-board / regulator. Since / EN1 & EN2 pins / are pulled down, / this also cuts / power to our / E-Paper screen / & peripherals.
tStop: THE OPEN BOOK
bDocu: 306070 1800 mAh battery / https://www.aliexpress.com/item/32927730430.html | 505060 2000mAh battery / https://www.aliexpress.com/item/32909666222.html | 785060 2500 mAh battery / https://adafru.it/2011 / / WARNING: Thick at ~7.2mm | 494251 1500 mAh battery / https://www.aliexpress.com/item/33046960888.html | 803860 2000 mAh battery / https://adafru.it/2011 / / WARNING: Thick at ~7.5mm